# EAGLE schematic SpeakerStuff (EAGLE 9.6.2)
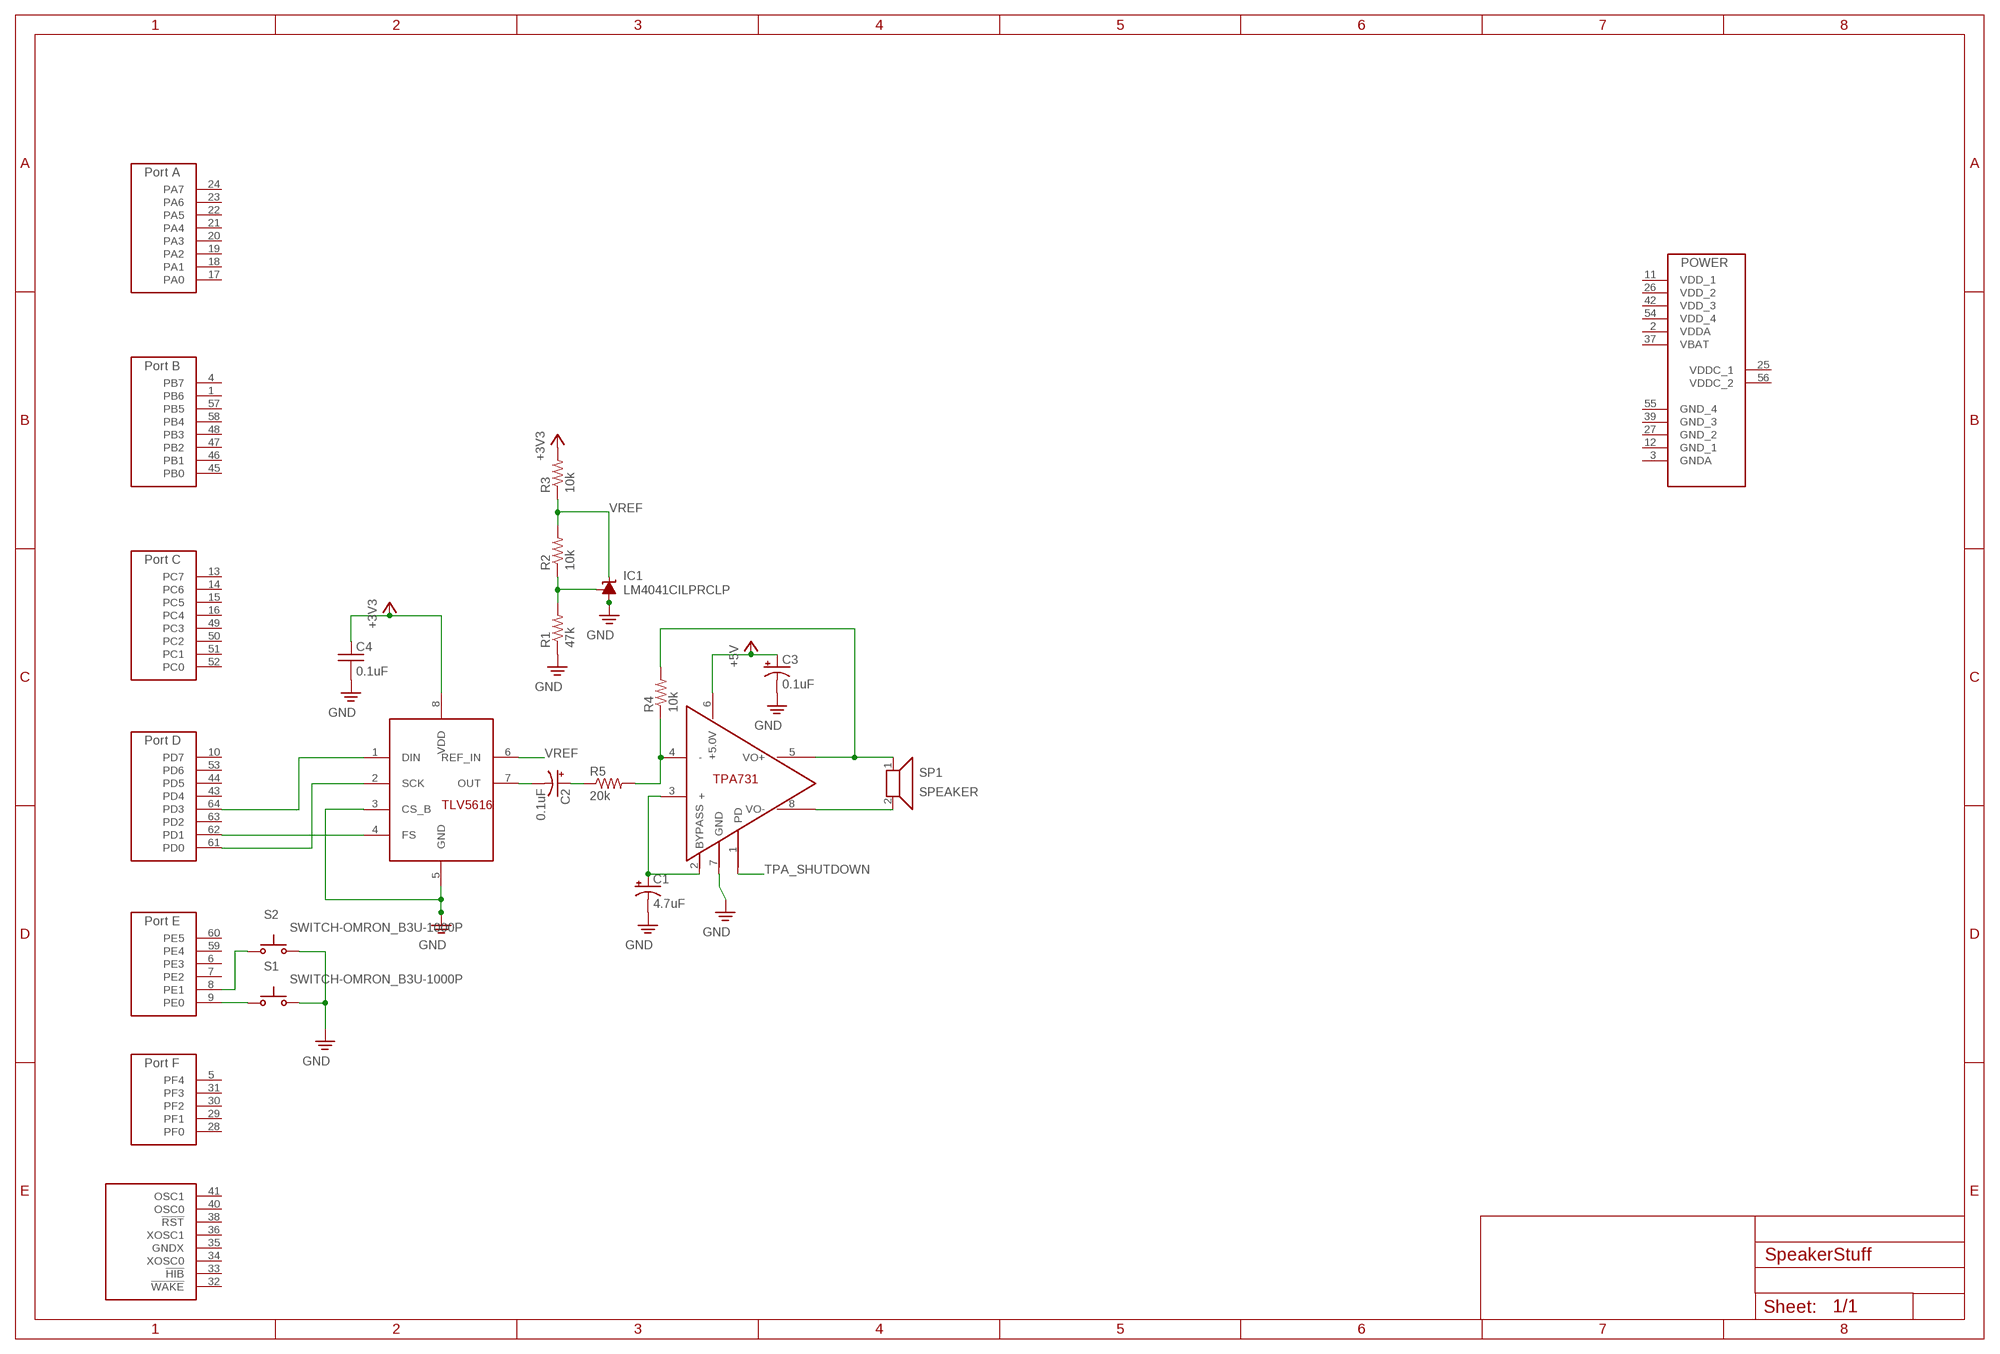
[diagram p0: schematic, sheet 1]

## Parts
C1  4.7uF  CAPACITOR_POLARIZEDE5-6  [CAP200MILPOLARIZED]
C2  0.1uF  CAPACITOR_POLARIZEDE5-6  [CAP200MILPOLARIZED]
C3  0.1uF  CAPACITOR_POLARIZEDE5-6  [CAP200MILPOLARIZED]
C4  0.1uF  CAPACITORC0603K  [C0603K]
IC1  LM4041CILPRCLP  [LP_O-PBCY-W3]
R1  47k  RESISTORR0603  [R0603]
R2  10k  RESISTORR0603  [R0603]
R3  10k  RESISTORR0603  [R0603]
R4  10k  RESISTORR0603  [R0603]
R5  20k  RESISTORR0603  [R0603]
S1  SWITCH-OMRON_B3U-1000P  [SWITCH-OMRON_B3U-1000P]
S2  SWITCH-OMRON_B3U-1000P  [SWITCH-OMRON_B3U-1000P]
SP1  SPEAKER  [1X02]
U$1  TM4C123GH6PM  [QFP50P1200X1200X160-64N]
U$2  TM4C123GH6PM  [QFP50P1200X1200X160-64N]
U$3  TM4C123GH6PM  [QFP50P1200X1200X160-64N]
U$4  TM4C123GH6PM  [QFP50P1200X1200X160-64N]
U$5  TM4C123GH6PM  [QFP50P1200X1200X160-64N]
U$6  TM4C123GH6PM  [QFP50P1200X1200X160-64N]
U$7  TM4C123GH6PM  [QFP50P1200X1200X160-64N]
U$8  TM4C123GH6PM  [QFP50P1200X1200X160-64N]
U$9  TLV5616  [DIL08]
U$10  TPA731  [SO08]

## Nets
+3V3: C4.1 R3.2 U$9.8(VDD)
+5V: C3.+ U$10.6(+5.0V)
GND: C1.- C3.- C4.2 IC1.3(A) R1.1 S1.2(S) S2.2(S) U$9.3(CS_B) U$9.5(GND) U$10.7(GND)
N$1: IC1.1(FB) R1.2 R2.1
N$2: C1.+ U$10.2(BYPASS) U$10.3(+)
N$3: C2.- U$9.7(OUT)
N$4: C2.+ R5.1
N$5: R4.1 R5.2 U$10.4(-)
N$6: R4.2 SP1.1 U$10.5(VO+)
N$7: SP1.2 U$10.8(VO-)
N$8: U$5.64(PD3) U$9.1(DIN)
N$9: U$5.61(PD0) U$9.2(SCK)
N$10: S1.1(P) U$6.9(PE0)
N$11: U$5.62(PD1) U$9.4(FS)
N$12: S2.1(P) U$6.8(PE1)
TPA_SHUTDOWN: U$10.1(PD)
VREF: IC1.2(C) R2.2 R3.1 U$9.6(REF_IN)
Unconnected: U$1.1(PB6) U$1.2(VDDA) U$1.3(GNDA) U$1.4(PB7) U$1.5(PF4) U$1.6(PE3) U$1.7(PE2) U$1.8(PE1) U$1.9(PE0) U$1.10(PD7) U$1.11(VDD_1) U$1.12(GND_1) U$1.13(PC7) U$1.14(PC6) U$1.15(PC5) U$1.16(PC4) U$1.17(PA0) U$1.18(PA1) U$1.19(PA2) U$1.20(PA3) U$1.21(PA4) U$1.22(PA5) U$1.23(PA6) U$1.24(PA7) U$1.25(VDDC_1) U$1.26(VDD_2) U$1.27(GND_2) U$1.28(PF0) U$1.29(PF1) U$1.30(PF2) U$1.31(PF3) U$1.32(!WAKE) U$1.33(!HIB) U$1.34(XOSC0) U$1.35(GNDX) U$1.36(XOSC1) U$1.37(VBAT) U$1.38(!RST) U$1.39(GND_3) U$1.40(OSC0) U$1.41(OSC1) U$1.42(VDD_3) U$1.43(PD4) U$1.44(PD5) U$1.45(PB0) U$1.46(PB1) U$1.47(PB2) U$1.48(PB3) U$1.49(PC3) U$1.50(PC2) U$1.51(PC1) U$1.52(PC0) U$1.53(PD6) U$1.54(VDD_4) U$1.55(GND_4) U$1.56(VDDC_2) U$1.57(PB5) U$1.58(PB4) U$1.59(PE4) U$1.60(PE5) U$1.61(PD0) U$1.62(PD1) U$1.63(PD2) U$1.64(PD3) U$2.1(PB6) U$2.2(VDDA) U$2.3(GNDA) U$2.4(PB7) U$2.5(PF4) U$2.6(PE3) U$2.7(PE2) U$2.8(PE1) U$2.9(PE0) U$2.10(PD7) U$2.11(VDD_1) U$2.12(GND_1) U$2.13(PC7) U$2.14(PC6) U$2.15(PC5) U$2.16(PC4) U$2.17(PA0) U$2.18(PA1) U$2.19(PA2) U$2.20(PA3) U$2.21(PA4) U$2.22(PA5) U$2.23(PA6) U$2.24(PA7) U$2.25(VDDC_1) U$2.26(VDD_2) U$2.27(GND_2) U$2.28(PF0) U$2.29(PF1) U$2.30(PF2) U$2.31(PF3) U$2.32(!WAKE) U$2.33(!HIB) U$2.34(XOSC0) U$2.35(GNDX) U$2.36(XOSC1) U$2.37(VBAT) U$2.38(!RST) U$2.39(GND_3) U$2.40(OSC0) U$2.41(OSC1) U$2.42(VDD_3) U$2.43(PD4) U$2.44(PD5) U$2.45(PB0) U$2.46(PB1) U$2.47(PB2) U$2.48(PB3) U$2.49(PC3) U$2.50(PC2) U$2.51(PC1) U$2.52(PC0) U$2.53(PD6) U$2.54(VDD_4) U$2.55(GND_4) U$2.56(VDDC_2) U$2.57(PB5) U$2.58(PB4) U$2.59(PE4) U$2.60(PE5) U$2.61(PD0) U$2.62(PD1) U$2.63(PD2) U$2.64(PD3) U$3.1(PB6) U$3.2(VDDA) U$3.3(GNDA) U$3.4(PB7) U$3.5(PF4) U$3.6(PE3) U$3.7(PE2) U$3.8(PE1) U$3.9(PE0) U$3.10(PD7) U$3.11(VDD_1) U$3.12(GND_1) U$3.13(PC7) U$3.14(PC6) U$3.15(PC5) U$3.16(PC4) U$3.17(PA0) U$3.18(PA1) U$3.19(PA2) U$3.20(PA3) U$3.21(PA4) U$3.22(PA5) U$3.23(PA6) U$3.24(PA7) U$3.25(VDDC_1) U$3.26(VDD_2) U$3.27(GND_2) U$3.28(PF0) U$3.29(PF1) U$3.30(PF2) U$3.31(PF3) U$3.32(!WAKE) U$3.33(!HIB) U$3.34(XOSC0) U$3.35(GNDX) U$3.36(XOSC1) U$3.37(VBAT) U$3.38(!RST) U$3.39(GND_3) U$3.40(OSC0) U$3.41(OSC1) U$3.42(VDD_3) U$3.43(PD4) U$3.44(PD5) U$3.45(PB0) U$3.46(PB1) U$3.47(PB2) U$3.48(PB3) U$3.49(PC3) U$3.50(PC2) U$3.51(PC1) U$3.52(PC0) U$3.53(PD6) U$3.54(VDD_4) U$3.55(GND_4) U$3.56(VDDC_2) U$3.57(PB5) U$3.58(PB4) U$3.59(PE4) U$3.60(PE5) U$3.61(PD0) U$3.62(PD1) U$3.63(PD2) U$3.64(PD3) U$4.1(PB6) U$4.2(VDDA) U$4.3(GNDA) U$4.4(PB7) U$4.5(PF4) U$4.6(PE3) U$4.7(PE2) U$4.8(PE1) U$4.9(PE0) U$4.10(PD7) U$4.11(VDD_1) U$4.12(GND_1) U$4.13(PC7) U$4.14(PC6) U$4.15(PC5) U$4.16(PC4) U$4.17(PA0) U$4.18(PA1) U$4.19(PA2) U$4.20(PA3) U$4.21(PA4) U$4.22(PA5) U$4.23(PA6) U$4.24(PA7) U$4.25(VDDC_1) U$4.26(VDD_2) U$4.27(GND_2) U$4.28(PF0) U$4.29(PF1) U$4.30(PF2) U$4.31(PF3) U$4.32(!WAKE) U$4.33(!HIB) U$4.34(XOSC0) U$4.35(GNDX) U$4.36(XOSC1) U$4.37(VBAT) U$4.38(!RST) U$4.39(GND_3) U$4.40(OSC0) U$4.41(OSC1) U$4.42(VDD_3) U$4.43(PD4) U$4.44(PD5) U$4.45(PB0) U$4.46(PB1) U$4.47(PB2) U$4.48(PB3) U$4.49(PC3) U$4.50(PC2) U$4.51(PC1) U$4.52(PC0) U$4.53(PD6) U$4.54(VDD_4) U$4.55(GND_4) U$4.56(VDDC_2) U$4.57(PB5) U$4.58(PB4) U$4.59(PE4) U$4.60(PE5) U$4.61(PD0) U$4.62(PD1) U$4.63(PD2) U$4.64(PD3) U$5.1(PB6) U$5.2(VDDA) U$5.3(GNDA) U$5.4(PB7) U$5.5(PF4) U$5.6(PE3) U$5.7(PE2) U$5.8(PE1) U$5.9(PE0) U$5.10(PD7) U$5.11(VDD_1) U$5.12(GND_1) U$5.13(PC7) U$5.14(PC6) U$5.15(PC5) U$5.16(PC4) U$5.17(PA0) U$5.18(PA1) U$5.19(PA2) U$5.20(PA3) U$5.21(PA4) U$5.22(PA5) U$5.23(PA6) U$5.24(PA7) U$5.25(VDDC_1) U$5.26(VDD_2) U$5.27(GND_2) U$5.28(PF0) U$5.29(PF1) U$5.30(PF2) U$5.31(PF3) U$5.32(!WAKE) U$5.33(!HIB) U$5.34(XOSC0) U$5.35(GNDX) U$5.36(XOSC1) U$5.37(VBAT) U$5.38(!RST) U$5.39(GND_3) U$5.40(OSC0) U$5.41(OSC1) U$5.42(VDD_3) U$5.43(PD4) U$5.44(PD5) U$5.45(PB0) U$5.46(PB1) U$5.47(PB2) U$5.48(PB3) U$5.49(PC3) U$5.50(PC2) U$5.51(PC1) U$5.52(PC0) U$5.53(PD6) U$5.54(VDD_4) U$5.55(GND_4) U$5.56(VDDC_2) U$5.57(PB5) U$5.58(PB4) U$5.59(PE4) U$5.60(PE5) U$5.63(PD2) U$6.1(PB6) U$6.2(VDDA) U$6.3(GNDA) U$6.4(PB7) U$6.5(PF4) U$6.6(PE3) U$6.7(PE2) U$6.10(PD7) U$6.11(VDD_1) U$6.12(GND_1) U$6.13(PC7) U$6.14(PC6) U$6.15(PC5) U$6.16(PC4) U$6.17(PA0) U$6.18(PA1) U$6.19(PA2) U$6.20(PA3) U$6.21(PA4) U$6.22(PA5) U$6.23(PA6) U$6.24(PA7) U$6.25(VDDC_1) U$6.26(VDD_2) U$6.27(GND_2) U$6.28(PF0) U$6.29(PF1) U$6.30(PF2) U$6.31(PF3) U$6.32(!WAKE) U$6.33(!HIB) U$6.34(XOSC0) U$6.35(GNDX) U$6.36(XOSC1) U$6.37(VBAT) U$6.38(!RST) U$6.39(GND_3) U$6.40(OSC0) U$6.41(OSC1) U$6.42(VDD_3) U$6.43(PD4) U$6.44(PD5) U$6.45(PB0) U$6.46(PB1) U$6.47(PB2) U$6.48(PB3) U$6.49(PC3) U$6.50(PC2) U$6.51(PC1) U$6.52(PC0) U$6.53(PD6) U$6.54(VDD_4) U$6.55(GND_4) U$6.56(VDDC_2) U$6.57(PB5) U$6.58(PB4) U$6.59(PE4) U$6.60(PE5) U$6.61(PD0) U$6.62(PD1) U$6.63(PD2) U$6.64(PD3) U$7.1(PB6) U$7.2(VDDA) U$7.3(GNDA) U$7.4(PB7) U$7.5(PF4) U$7.6(PE3) U$7.7(PE2) U$7.8(PE1) U$7.9(PE0) U$7.10(PD7) U$7.11(VDD_1) U$7.12(GND_1) U$7.13(PC7) U$7.14(PC6) U$7.15(PC5) U$7.16(PC4) U$7.17(PA0) U$7.18(PA1) U$7.19(PA2) U$7.20(PA3) U$7.21(PA4) U$7.22(PA5) U$7.23(PA6) U$7.24(PA7) U$7.25(VDDC_1) U$7.26(VDD_2) U$7.27(GND_2) U$7.28(PF0) U$7.29(PF1) U$7.30(PF2) U$7.31(PF3) U$7.32(!WAKE) U$7.33(!HIB) U$7.34(XOSC0) U$7.35(GNDX) U$7.36(XOSC1) U$7.37(VBAT) U$7.38(!RST) U$7.39(GND_3) U$7.40(OSC0) U$7.41(OSC1) U$7.42(VDD_3) U$7.43(PD4) U$7.44(PD5) U$7.45(PB0) U$7.46(PB1) U$7.47(PB2) U$7.48(PB3) U$7.49(PC3) U$7.50(PC2) U$7.51(PC1) U$7.52(PC0) U$7.53(PD6) U$7.54(VDD_4) U$7.55(GND_4) U$7.56(VDDC_2) U$7.57(PB5) U$7.58(PB4) U$7.59(PE4) U$7.60(PE5) U$7.61(PD0) U$7.62(PD1) U$7.63(PD2) U$7.64(PD3) U$8.1(PB6) U$8.2(VDDA) U$8.3(GNDA) U$8.4(PB7) U$8.5(PF4) U$8.6(PE3) U$8.7(PE2) U$8.8(PE1) U$8.9(PE0) U$8.10(PD7) U$8.11(VDD_1) U$8.12(GND_1) U$8.13(PC7) U$8.14(PC6) U$8.15(PC5) U$8.16(PC4) U$8.17(PA0) U$8.18(PA1) U$8.19(PA2) U$8.20(PA3) U$8.21(PA4) U$8.22(PA5) U$8.23(PA6) U$8.24(PA7) U$8.25(VDDC_1) U$8.26(VDD_2) U$8.27(GND_2) U$8.28(PF0) U$8.29(PF1) U$8.30(PF2) U$8.31(PF3) U$8.32(!WAKE) U$8.33(!HIB) U$8.34(XOSC0) U$8.35(GNDX) U$8.36(XOSC1) U$8.37(VBAT) U$8.38(!RST) U$8.39(GND_3) U$8.40(OSC0) U$8.41(OSC1) U$8.42(VDD_3) U$8.43(PD4) U$8.44(PD5) U$8.45(PB0) U$8.46(PB1) U$8.47(PB2) U$8.48(PB3) U$8.49(PC3) U$8.50(PC2) U$8.51(PC1) U$8.52(PC0) U$8.53(PD6) U$8.54(VDD_4) U$8.55(GND_4) U$8.56(VDDC_2) U$8.57(PB5) U$8.58(PB4) U$8.59(PE4) U$8.60(PE5) U$8.61(PD0) U$8.62(PD1) U$8.63(PD2) U$8.64(PD3)

## Library data of the parts
C1-C3 = EE445L:CAPACITOR_POLARIZED: POLARIZED CAPACITOR, American symbol
C4 = EE445L:CAPACITOR: CAPACITOR, American symbol
IC1 = EE445L:LM4041CILPR: PRECISION MICROPOWER SHUNT VOLTAGE REFERENCE Adjustable Output Source: http://focus.ti.com/lit/ds/slcs146e/slcs146e.pdf LM4041CILPR Let R1 be the resistor from Vref to +3.3V Let R2 be the resistor from Vref to FB Let R3 be the resistor from FB to ground Vref = 1.23*(1+R3/R2) Iref=(3.3V-Vref)/R1 - 100uA; MPN: LM4041CILP; OC_FARNELL: 1673945; OC_NEWARK: 50M8856
R1-R5 = EE445L:RESISTOR: RESISTOR, American symbol
S1 S2 = 52101-101-REV-A_v16:SWITCH-OMRON_B3U-1000P: SMD Tactile Switch - Ultra Small
SP1 = EE445L:SPEAKER: Speaker Connected off PCB with two wires. 32-ohm speaker, AllElectronics, SK-230, http://www.allelectronics.com/make-a-store/item/sk-230/20-mm-32-ohm-speaker/1.html
U$1-U$8 = EE445L:TM4C123GH6PM
U$9 = EE445L:TLV5616
U$10 = EE445L:TPA731